# Altium schematic sheet sptMem2K.SCHDOC: LiveDesign Evaluation - Video Games
size B; Organization: Altium Limited; Address1: L3, 12a Rodborough Rd; Address2: Frenchs Forest; Address3: NSW; Address4: Australia 2086; DocumentNumber: 3; SheetNumber: 3; SheetTotal: 13
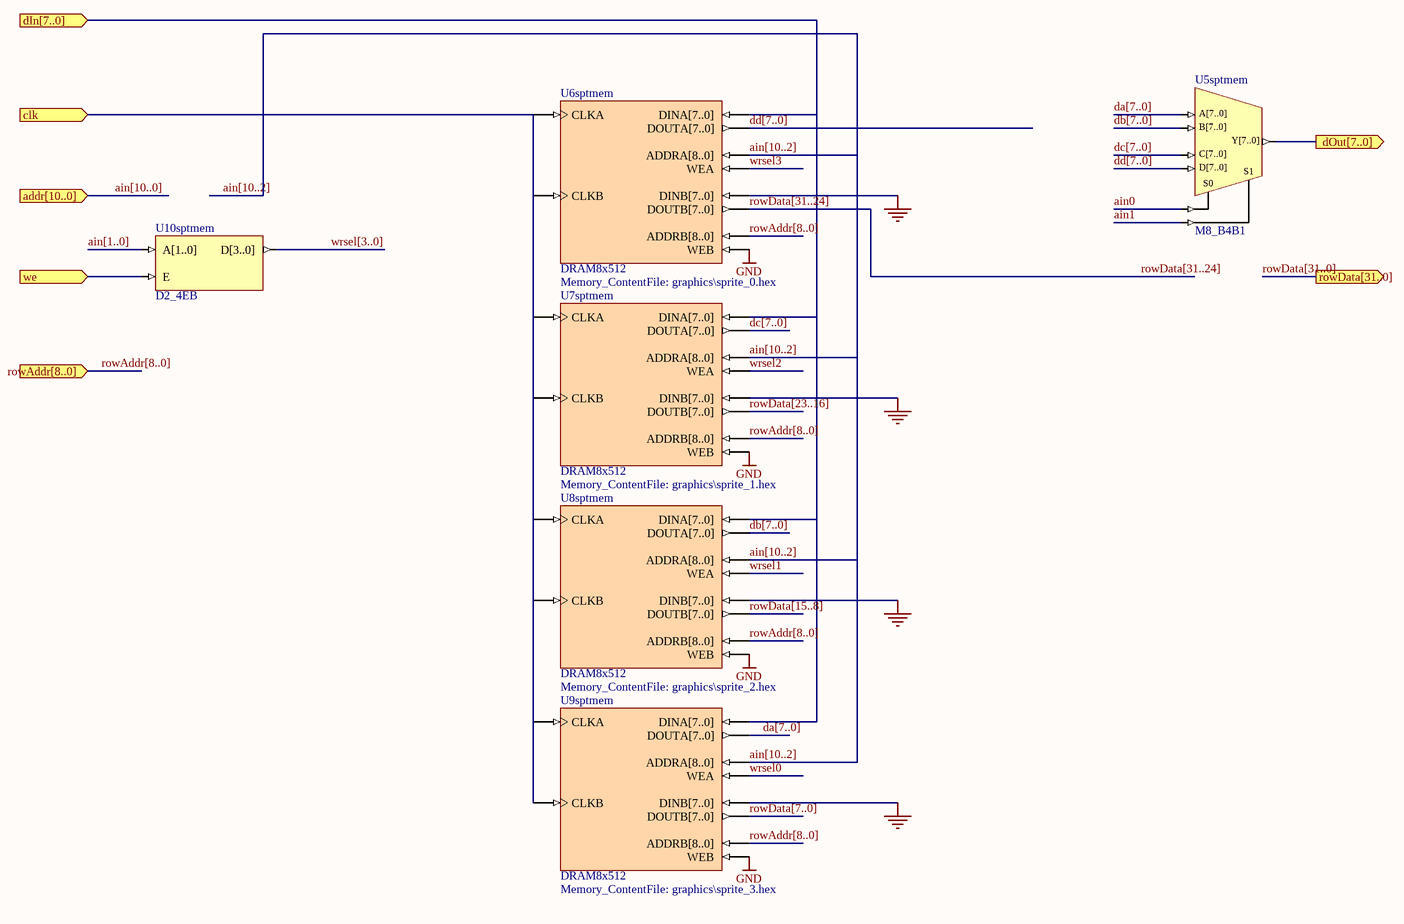
[diagram p0: sptMem2K.SCHDOC]

## Parts
U5sptmem  M8_B4B1
U6sptmem  DRAM8x512  Memory_ContentFile: graphics\sprite_0.hex
U7sptmem  DRAM8x512  Memory_ContentFile: graphics\sprite_1.hex
U8sptmem  DRAM8x512  Memory_ContentFile: graphics\sprite_2.hex
U9sptmem  DRAM8x512  Memory_ContentFile: graphics\sprite_3.hex
U10sptmem  D2_4EB

## Ports
addr[10..0] (in), clk (in), dIn[7..0] (in), dOut[7..0] (out), rowAddr[8..0] (in), rowData[31..0] (out), we (in)

## Nets
GND: U6sptmem.WEB U7sptmem.WEB U8sptmem.WEB U9sptmem.WEB
GNDBUS[..]: U6sptmem.DINB[7..0] U7sptmem.DINB[7..0] U8sptmem.DINB[7..0] U9sptmem.DINB[7..0]
ain0: U5sptmem.S0
ain1: U5sptmem.S1
ain[1..0]: U10sptmem.A[1..0]
ain[10..2]: U6sptmem.ADDRA[8..0] U7sptmem.ADDRA[8..0] U8sptmem.ADDRA[8..0] U9sptmem.ADDRA[8..0]
clk: U6sptmem.CLKA U6sptmem.CLKB U7sptmem.CLKA U7sptmem.CLKB U8sptmem.CLKA U8sptmem.CLKB U9sptmem.CLKA U9sptmem.CLKB ; port clk
da[7..0]: U5sptmem.A[7..0] U9sptmem.DOUTA[7..0]
db[7..0]: U5sptmem.B[7..0] U8sptmem.DOUTA[7..0]
dc[7..0]: U5sptmem.C[7..0] U7sptmem.DOUTA[7..0]
dd[7..0]: U5sptmem.D[7..0] U6sptmem.DOUTA[7..0]
dIn[7..0]: U6sptmem.DINA[7..0] U7sptmem.DINA[7..0] U8sptmem.DINA[7..0] U9sptmem.DINA[7..0] ; port dIn[7..0]
dOut[7..0]: U5sptmem.Y[7..0] ; port dOut[7..0]
rowAddr[8..0]: U6sptmem.ADDRB[8..0] U7sptmem.ADDRB[8..0] U8sptmem.ADDRB[8..0] U9sptmem.ADDRB[8..0] ; port rowAddr[8..0]
rowData[7..0]: U9sptmem.DOUTB[7..0]
rowData[15..8]: U8sptmem.DOUTB[7..0]
rowData[23..16]: U7sptmem.DOUTB[7..0]
rowData[31..24]: U6sptmem.DOUTB[7..0]
we: U10sptmem.E ; port we
wrsel0: U9sptmem.WEA
wrsel1: U8sptmem.WEA
wrsel2: U7sptmem.WEA
wrsel3: U6sptmem.WEA
wrsel[3..0]: U10sptmem.D[3..0]

## Buses and harness runs
bus ain[1..0]
bus ain[10..0] = port addr[10..0]
bus ain[10..2]
bus da[7..0]
bus db[7..0]
bus dc[7..0]
bus dd[7..0]
bus rowAddr[8..0]
bus rowAddr[8..0] = port rowAddr[8..0]
bus rowData[7..0]
bus rowData[15..8]
bus rowData[23..16]
bus rowData[31..0] = port rowData[31..0]
bus rowData[31..24]
bus wrsel[3..0]

## Notes on the sheet
- Labels drawn without touching a wire or pin: GNDBUS[..]
- Title
- Size:
- Date:
- B
- Number:
- Time:
- Revision:
- Sheet
- of
- File:

## Library data of the parts
U5sptmem = M8_B4B1: 4x8-Bit Bus to 1x8-Bit Bus Multiplexer; ArchiveName: GENERIC; Published: 9-30-2003; Publisher: Altium Limited; Core Revision: 1.00.00
U6sptmem U7sptmem U8sptmem U9sptmem = DRAM8x512: Dual Port Random Access Memory 512 x 8 and 512 x 8; Memory_DepthA: 512; Memory_Type: RAM_DualPortBlock; Memory_WidthA: 8; Memory_ClockEdge: Rising; Nexus_Core: Memory_Program; Published: 26/09/2003; Publisher: Altium Hobart Technology Center; Memory_DepthB: 512; Memory_WidthB: 8
U10sptmem = D2_4EB: Binary 2- to 4-Bit Decoder with Enable, Bus Version; ArchiveName: GENERIC; Published: 9-30-2003; Publisher: Altium Limited; Core Revision: 1.00.00